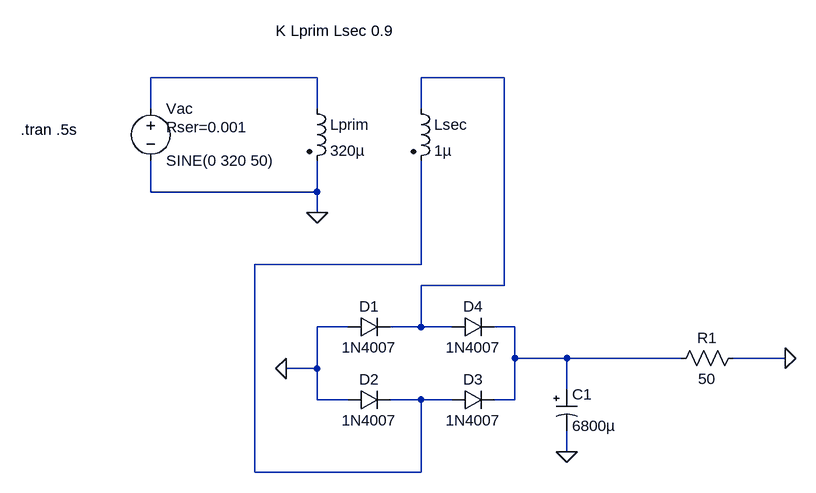
[diagram p0: schematic ac-dc-rectifier.asc]
ac-dc-rectifier.asc, the LTspice schematic file:
Version 4
SHEET 1 1352 680
WIRE 304 -480 48 -480
WIRE 592 -480 464 -480
WIRE 48 -432 48 -480
WIRE 304 -432 304 -480
WIRE 464 -432 464 -480
WIRE 48 -304 48 -352
WIRE 304 -304 304 -352
WIRE 304 -304 48 -304
WIRE 304 -272 304 -304
WIRE 464 -192 464 -352
WIRE 464 -192 208 -192
WIRE 592 -160 592 -480
WIRE 592 -160 464 -160
WIRE 352 -96 304 -96
WIRE 464 -96 464 -160
WIRE 464 -96 416 -96
WIRE 512 -96 464 -96
WIRE 608 -96 576 -96
WIRE 608 -48 608 -96
WIRE 688 -48 608 -48
WIRE 864 -48 688 -48
WIRE 1024 -48 944 -48
WIRE 304 -32 304 -96
WIRE 304 -32 256 -32
WIRE 688 0 688 -48
WIRE 304 16 304 -32
WIRE 352 16 304 16
WIRE 464 16 416 16
WIRE 512 16 464 16
WIRE 608 16 608 -48
WIRE 608 16 576 16
WIRE 688 96 688 64
WIRE 208 128 208 -192
WIRE 464 128 464 16
WIRE 464 128 208 128
FLAG 304 -272 0
FLAG 256 -32 0
FLAG 1024 -48 0
FLAG 688 96 0
SYMBOL diode 352 -80 R270
WINDOW 0 32 32 VTop 2
WINDOW 3 0 32 VBottom 2
SYMATTR InstName D1
SYMATTR Value 1N4007
SYMBOL voltage 48 -448 R0
WINDOW 123 0 0 Left 0
WINDOW 39 24 44 Left 2
SYMATTR SpiceLine Rser=0.001
SYMATTR InstName Vac
SYMATTR Value SINE(0 320 50)
SYMBOL ind2 288 -448 R0
SYMATTR InstName Lprim
SYMATTR Value 320µ
SYMATTR Type ind
SYMBOL ind2 448 -448 R0
SYMATTR InstName Lsec
SYMATTR Value 1µ
SYMATTR Type ind
SYMBOL diode 352 32 R270
WINDOW 0 32 32 VTop 2
WINDOW 3 0 32 VBottom 2
SYMATTR InstName D2
SYMATTR Value 1N4007
SYMBOL diode 512 32 R270
WINDOW 0 32 32 VTop 2
WINDOW 3 0 32 VBottom 2
SYMATTR InstName D3
SYMATTR Value 1N4007
SYMBOL diode 512 -80 R270
WINDOW 0 32 32 VTop 2
WINDOW 3 0 32 VBottom 2
SYMATTR InstName D4
SYMATTR Value 1N4007
SYMBOL res 960 -64 R90
WINDOW 0 0 56 VBottom 2
WINDOW 3 32 56 VTop 2
SYMATTR InstName R1
SYMATTR Value 50
SYMBOL polcap 672 0 R0
WINDOW 3 24 56 Left 2
SYMATTR Value 6800µ
SYMATTR InstName C1
SYMATTR Description Capacitor
SYMATTR Type cap
SYMATTR SpiceLine V=63 Irms=4.32 Rser=0.0372 Lser=19.088n mfg="Würth Elektronik" pn="861010786021 WCAP-AIG8 35x30" type="Al electrolytic"
TEXT -152 -400 Left 2 !.tran .5s
TEXT 240 -552 Left 2 !K Lprim Lsec 0.9

The netlist it stands for:
* ac-dc-rectifier.asc
D1 0 N002 1N4007
Vac N001 0 SINE(0 320 50) Rser=0.001
Lprim N001 0 320µ
Lsec N002 N003 1µ
D2 0 N003 1N4007
D3 N003 N004 1N4007
D4 N002 N004 1N4007
R1 0 N004 50
C1 N004 0 6800µ V=63 Irms=4.32 Rser=0.0372 Lser=19.088n mfg="Würth Elektronik" pn="861010786021 WCAP-AIG8 35x30" type="Al electrolytic"
.model D D
.lib standard.dio
.tran .5s
K Lprim Lsec 0.9
.backanno
.end